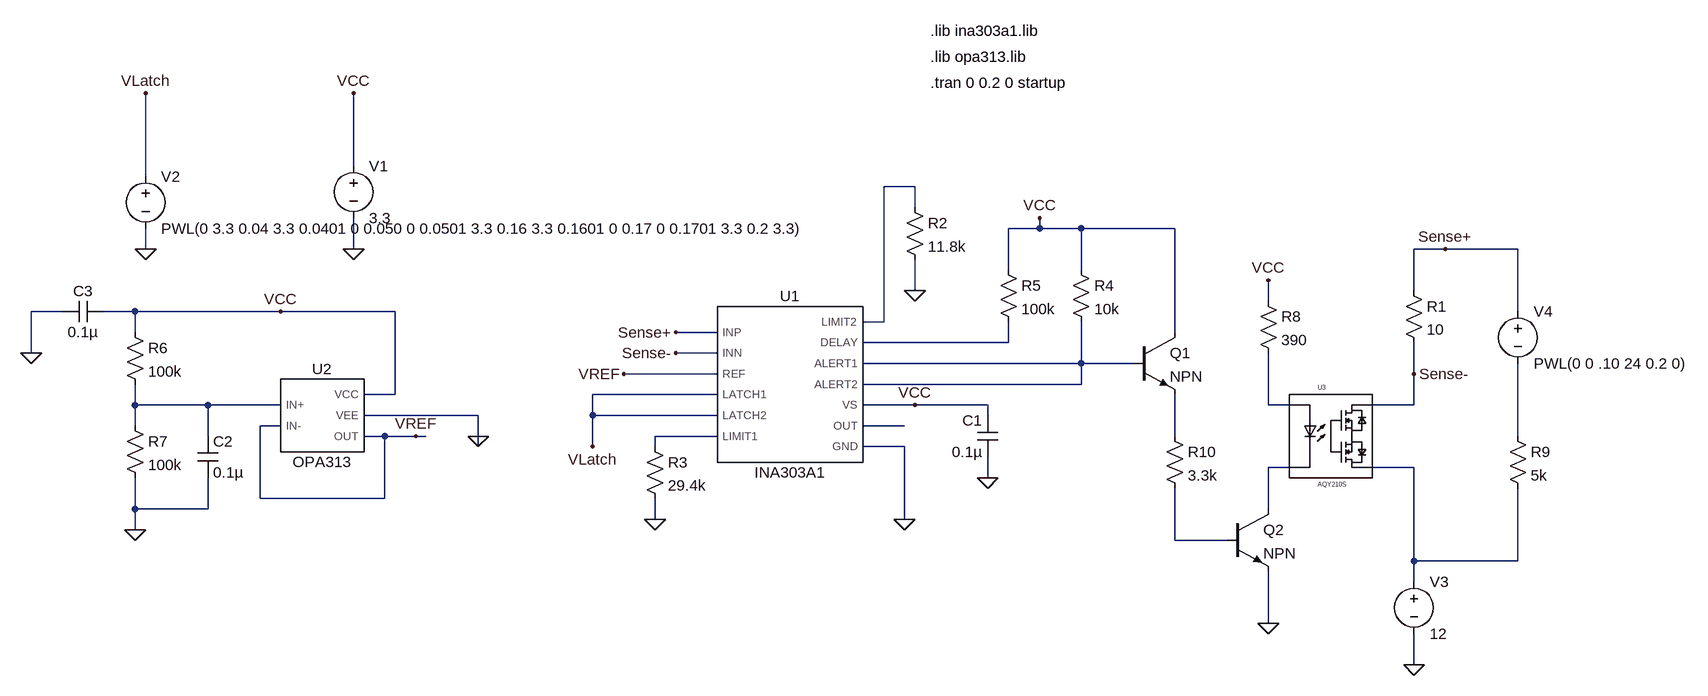
[diagram p0: schematic gvs_safety.asc]
gvs_safety.asc, the LTspice schematic file:
Version 4.1
SHEET 1 2696 680
WIRE 320 -176 320 -288
WIRE 0 -160 0 -288
WIRE 1184 -144 1136 -144
WIRE 1184 -112 1184 -144
WIRE 1376 -80 1376 -96
WIRE 1376 -80 1328 -80
WIRE 1440 -80 1376 -80
WIRE 1584 -80 1440 -80
WIRE 0 -48 0 -80
WIRE 320 -48 320 -96
WIRE 2000 -48 1952 -48
WIRE 2112 -48 2000 -48
WIRE 1328 -16 1328 -80
WIRE 1440 -16 1440 -80
WIRE 1184 16 1184 -32
WIRE 1952 16 1952 -48
WIRE 1728 32 1728 0
WIRE -128 48 -176 48
WIRE -16 48 -64 48
WIRE 208 48 -16 48
WIRE 384 48 208 48
WIRE 2112 48 2112 -48
WIRE 1136 64 1136 -144
WIRE 1136 64 1104 64
WIRE -16 80 -16 48
WIRE 880 80 816 80
WIRE 1584 80 1584 -80
WIRE 1328 96 1328 64
WIRE 1328 96 1104 96
WIRE -176 112 -176 48
WIRE 880 112 816 112
WIRE 1440 128 1440 64
WIRE 1440 128 1104 128
WIRE 1520 128 1440 128
WIRE 880 144 736 144
WIRE 1952 144 1952 96
WIRE 1440 160 1440 128
WIRE 1440 160 1104 160
WIRE 384 176 384 48
WIRE 384 176 336 176
WIRE 880 176 688 176
WIRE -16 192 -16 160
WIRE 96 192 -16 192
WIRE 208 192 96 192
WIRE 1184 192 1104 192
WIRE 1296 192 1184 192
WIRE 1728 192 1728 112
WIRE 1760 192 1728 192
WIRE 1952 192 1952 144
WIRE 1952 192 1888 192
WIRE 512 208 336 208
WIRE 688 208 688 176
WIRE 880 208 688 208
WIRE 1296 208 1296 192
WIRE -16 224 -16 192
WIRE 208 224 176 224
WIRE 1168 224 1104 224
WIRE 96 240 96 192
WIRE 368 240 336 240
WIRE 416 240 368 240
WIRE 432 240 416 240
WIRE 512 240 512 208
WIRE 880 240 784 240
WIRE 1584 240 1584 176
WIRE 2112 240 2112 128
WIRE 512 256 512 240
WIRE 688 256 688 208
WIRE 784 256 784 240
WIRE 1168 256 1104 256
WIRE 1760 288 1728 288
WIRE 1952 288 1888 288
WIRE 1296 304 1296 272
WIRE 176 336 176 224
WIRE 368 336 368 240
WIRE 368 336 176 336
WIRE -16 352 -16 304
WIRE 96 352 96 304
WIRE 96 352 -16 352
WIRE 1728 352 1728 288
WIRE 784 368 784 336
WIRE 1168 368 1168 256
WIRE -16 384 -16 352
WIRE 1584 400 1584 320
WIRE 1664 400 1584 400
WIRE 1952 432 1952 288
WIRE 2112 432 2112 320
WIRE 2112 432 1952 432
WIRE 1952 464 1952 432
WIRE 1728 528 1728 448
WIRE 1952 592 1952 544
FLAG 1168 368 0
FLAG 1184 16 0
FLAG 1184 192 VCC
FLAG 320 -48 0
FLAG 320 -288 VCC
FLAG 784 368 0
FLAG 1376 -96 VCC
FLAG 1952 592 0
FLAG 2000 -48 Sense+
FLAG 816 80 Sense+
FLAG 816 112 Sense-
FLAG 736 144 VREF
FLAG 1952 144 Sense-
FLAG -16 384 0
FLAG 416 240 VREF
FLAG 512 240 0
FLAG -176 112 0
FLAG 208 48 VCC
FLAG 1296 304 0
FLAG 0 -48 0
FLAG 0 -288 VLatch
FLAG 688 256 VLatch
FLAG 1728 0 VCC
FLAG 1728 528 0
SYMBOL res 1936 0 R0
SYMATTR InstName R1
SYMATTR Value 10
SYMBOL GVS\\INA303A1 992 160 R0
SYMATTR InstName U1
SYMBOL res 1168 -128 R0
SYMATTR InstName R2
SYMATTR Value 11.8k
SYMBOL voltage 320 -192 R0
WINDOW 123 0 0 Left 0
WINDOW 39 0 0 Left 0
SYMATTR InstName V1
SYMATTR Value 3.3
SYMBOL res 768 240 R0
SYMATTR InstName R3
SYMATTR Value 29.4k
SYMBOL res 1424 -32 R0
SYMATTR InstName R4
SYMATTR Value 10k
SYMBOL voltage 1952 448 R0
WINDOW 123 0 0 Left 0
WINDOW 39 0 0 Left 0
SYMATTR InstName V3
SYMATTR Value 12
SYMBOL res 1312 -32 R0
SYMATTR InstName R5
SYMATTR Value 100k
SYMBOL GVS\\OPA313 272 208 R0
SYMATTR InstName U2
SYMBOL res -32 64 R0
SYMATTR InstName R6
SYMATTR Value 100k
SYMBOL res -32 208 R0
SYMATTR InstName R7
SYMATTR Value 100k
SYMBOL cap 80 240 R0
SYMATTR InstName C2
SYMATTR Value 0.1µ
SYMBOL cap -64 32 R90
WINDOW 0 0 32 VBottom 2
WINDOW 3 32 32 VTop 2
SYMATTR InstName C3
SYMATTR Value 0.1µ
SYMBOL cap 1312 272 R180
WINDOW 0 24 56 Left 2
WINDOW 3 24 8 Left 2
SYMATTR InstName C1
SYMATTR Value 0.1µ
SYMBOL voltage 0 -176 R0
WINDOW 123 0 0 Left 0
WINDOW 39 0 0 Left 0
SYMATTR InstName V2
SYMATTR Value PWL(0 3.3 0.04 3.3 0.0401 0 0.050 0 0.0501 3.3 0.16 3.3 0.1601 0 0.17 0 0.1701 3.3 0.2 3.3)
SYMBOL GVS\\AQY210S 1824 240 R0
SYMATTR InstName U3
SYMBOL npn 1520 80 R0
SYMATTR InstName Q1
SYMBOL res 1712 16 R0
SYMATTR InstName R8
SYMATTR Value 390
SYMBOL res 2096 224 R0
SYMATTR InstName R9
SYMATTR Value 5k
SYMBOL res 1568 224 R0
SYMATTR InstName R10
SYMATTR Value 3.3k
SYMBOL npn 1664 352 R0
SYMATTR InstName Q2
SYMBOL voltage 2112 32 R0
WINDOW 123 0 0 Left 0
WINDOW 39 0 0 Left 0
SYMATTR InstName V4
SYMATTR Value PWL(0 0 .10 24 0.2 0)
TEXT 1208 -304 Left 2 !.tran 0 0.2 0 startup
TEXT 1208 -384 Left 2 !.lib ina303a1.lib
TEXT 1208 -344 Left 2 !.lib opa313.lib

The netlist it stands for:
* gvs_safety.asc
R1 Sense+ Sense- 10
X§U1 Sense+ Sense- VREF VLatch VLatch N007 N001 N002 N003 N003 VCC N006 0 INA303A1  ; pins INP INN REF LATCH1 LATCH2 LIMIT1 LIMIT2 DELAY ALERT1 ALERT2 VS OUT GND
R2 N001 0 11.8k
V1 VCC 0 3.3
R3 N007 0 29.4k
R4 VCC N003 10k
V3 N011 0 12
R5 VCC N002 100k
X§U2 N004 VREF VCC 0 VREF OPA313  ; pins IN+ IN- VCC VEE OUT
R6 VCC N004 100k
R7 N004 0 100k
C2 N004 0 0.1µ
C3 VCC 0 0.1µ
C1 0 VCC 0.1µ
V2 VLatch 0 PWL(0 3.3 0.04 3.3 0.0401 0 0.050 0 0.0501 3.3 0.16 3.3 0.1601 0 0.17 0 0.1701 3.3 0.2 3.3)
X§U3 N005 N010 N011 Sense- AQY210S  ; pins 1 2 3 4
Q1 VCC N003 N008 0 NPN
R8 VCC N005 390
R9 N009 N011 5k
R10 N008 N012 3.3k
Q2 N010 N012 0 0 NPN
V4 Sense+ N009 PWL(0 0 .10 24 0.2 0)
.model NPN NPN
.model PNP PNP
.lib standard.bjt
.tran 0 0.2 0 startup
.lib ina303a1.lib
.lib opa313.lib
.lib ina303a1.lib
.lib opa313.lib
.lib AQY210S_LTspice.lib
.backanno
.end

* Results of the author's LTspice run, read from the files saved beside the schematic
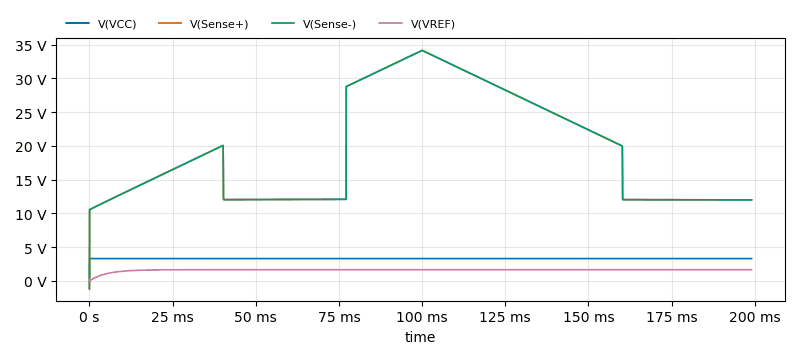
[diagram p1: Transient Analysis of gvs_safety.asc, plotted from the saved traces]
* Transient Analysis, 1 run:
*   V(VCC): min 0 V, max 3.3 V, average 3.3 V, rms 3.3 V, last 3.3 V
*   V(Sense+): min -1.178 V, max 34.17 V, average 19.45 V, rms 21.07 V, last 11.99 V
*   V(Sense-): min -1.179 V, max 34.17 V, average 19.45 V, rms 21.06 V, last 12 V
*   V(VREF): min 895.3 µV, max 1.65 V, average 1.609 V, rms 1.619 V, last 1.65 V